# Altium project GLOVETESTER-NFCBOARD.PrjPcb
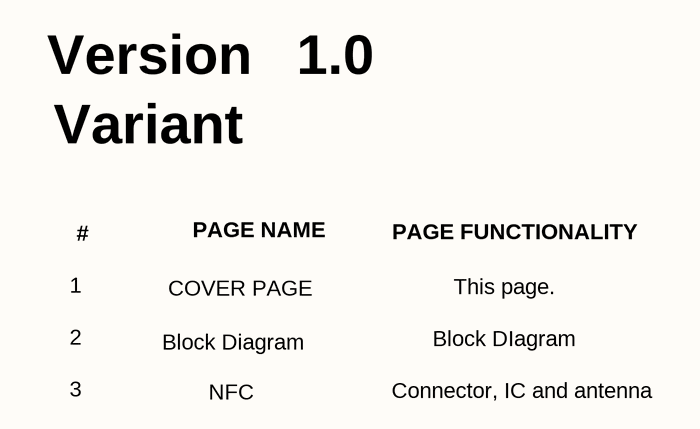
[diagram p0: 01 COVER PAGE.SchDoc]
3 sheets, 51 parts. Net scope: global (net labels, ports and power ports of the same name join across sheets).
Board file: NFC.PcbDoc
Sheets:
  01 COVER PAGE.SchDoc
  02 BLOCK DIAGRAM.SchDoc
  03 NFC.SchDoc

## Sheet 01 COVER PAGE.SchDoc
size A3; SheetNumber: 1; SheetTotal: 3

### Notes on the sheet
- Version
- 1.0
- Variant
- #
- PAGE NAME
- COVER PAGE
- PAGE FUNCTIONALITY
- This page.
- 1
- 2
- Block Diagram
- Block DIagram
- 3
- NFC
- Connector, IC and antenna
- Size
- Author
- Revision
- embedded-consultants.com <http://embedded-consultants.com>
- Sheet
- Date
- of

## Sheet 02 BLOCK DIAGRAM.SchDoc
size A3; SheetNumber: 2; SheetTotal: 3
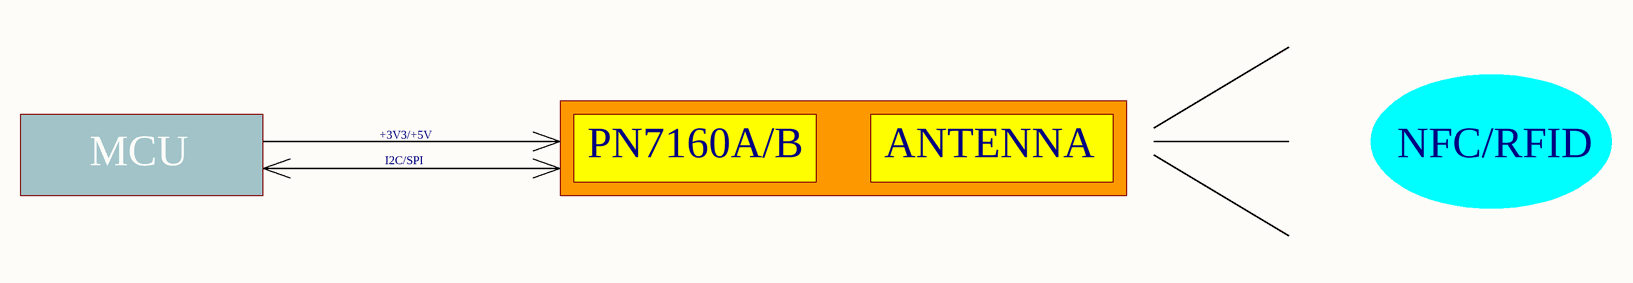
[diagram p1: 02 BLOCK DIAGRAM.SchDoc]

### Notes on the sheet
- +3V3/+5V
- I2C/SPI
- PN7160A/B
- ANTENNA
- NFC/RFID
- MCU
- Size
- Author
- Revision
- embedded-consultants.com <http://embedded-consultants.com>
- Sheet
- Date
- of

## Sheet 03 NFC.SchDoc: 03 NFC
size A3; Date: 2026.4.28.; Author: Silard G.; Revision: 1.0; SheetNumber: 3; SheetTotal: 3; Size: A3
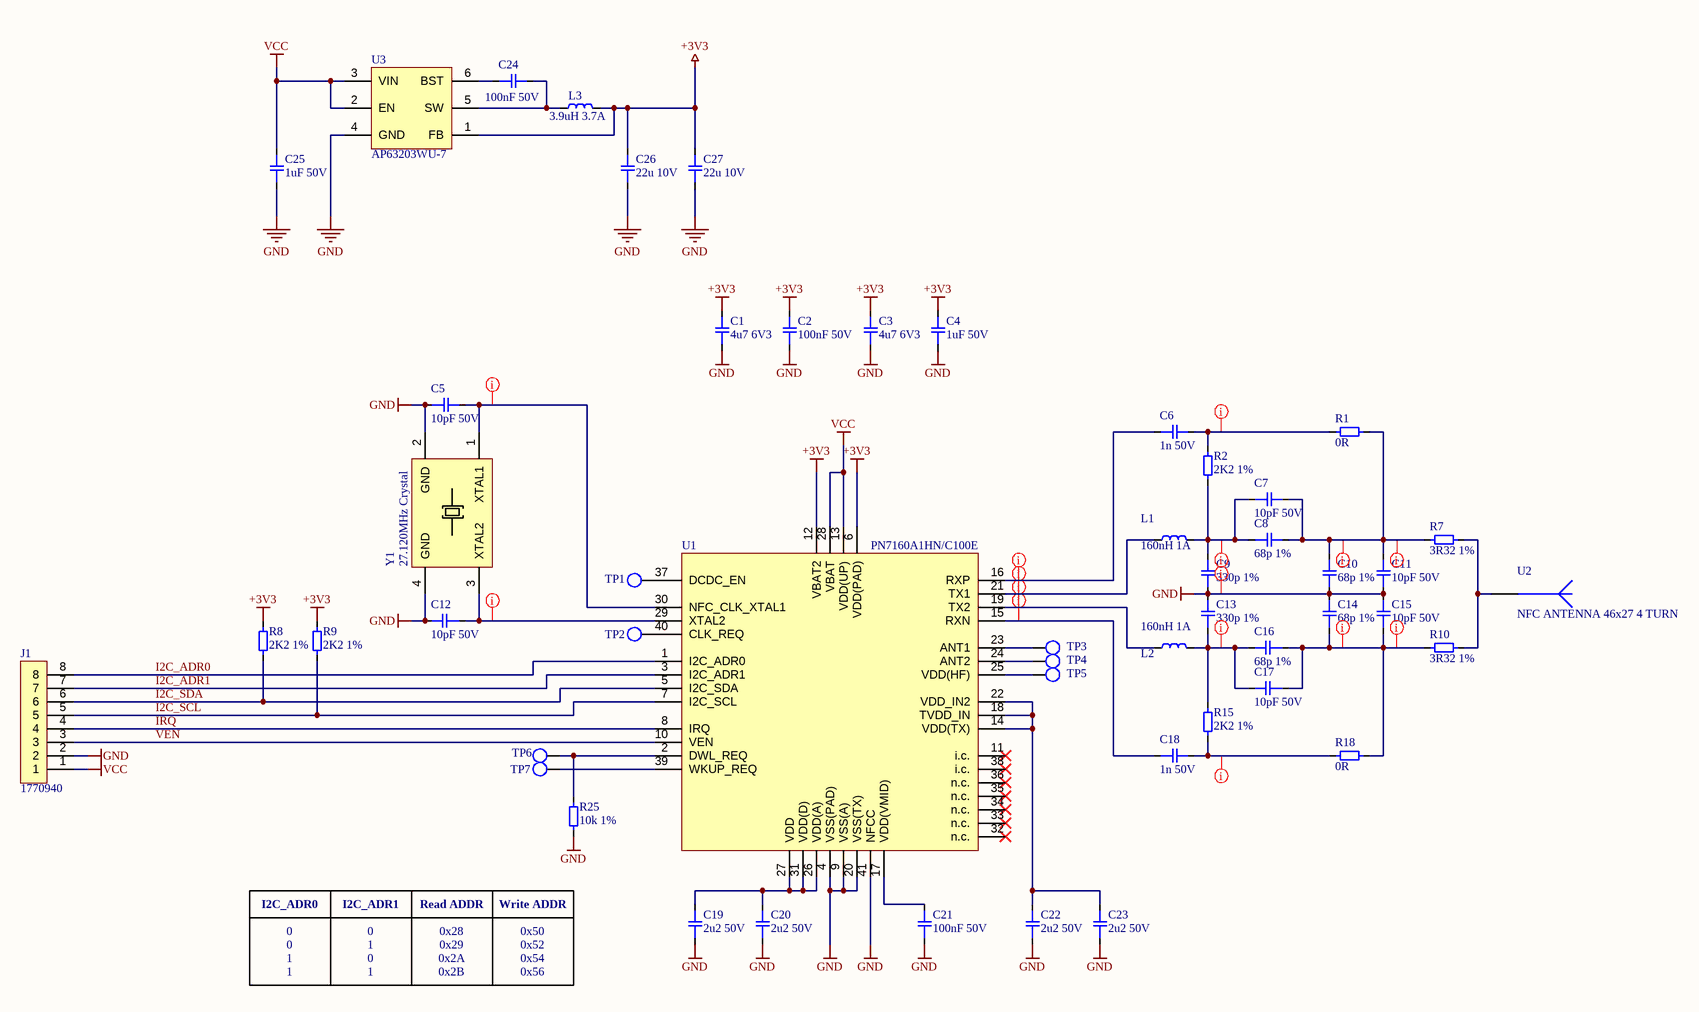
[diagram p2: 03 NFC.SchDoc]

### Parts
C1  4u7 6V3  [CAPC1005X05N_MURATA_GRT]
C2  100nF 50V  [CAPC1005X05N_MURATA_GCM]
C3  4u7 6V3  [CAPC1005X05N_MURATA_GRT]
C4  1uF 50V  [CAPC1005X05N_MURATA_GRM]
C5  10pF 50V  [CAPC1005X05N_MURATA_GRM]
C6  1n 50V  [CAPC1005X05N_MURATA_GCM]
C7  10pF 50V  [CAPC1005X05N_MURATA_GRM]
C8  68p 1%  [CAPC1005X05N_MURATA_GCM]
C9  330p 1%  [CAPC1005X05N_MURATA_GCM]
C10  68p 1%  [CAPC1005X05N_MURATA_GCM]
C11  10pF 50V  [CAPC1005X05N_MURATA_GRM]
C12  10pF 50V  [CAPC1005X05N_MURATA_GRM]
C13  330p 1%  [CAPC1005X05N_MURATA_GCM]
C14  68p 1%  [CAPC1005X05N_MURATA_GCM]
C15  10pF 50V  [CAPC1005X05N_MURATA_GRM]
C16  68p 1%  [CAPC1005X05N_MURATA_GCM]
C17  10pF 50V  [CAPC1005X05N_MURATA_GRM]
C18  1n 50V  [CAPC1005X05N_MURATA_GCM]
C19  2u2 50V  [CAPC1608X08N_MURATA_GRT]
C20  2u2 50V  [CAPC1608X08N_MURATA_GRT]
C21  100nF 50V  [CAPC1005X05N_MURATA_GCM]
C22  2u2 50V  [CAPC1608X08N_MURATA_GRT]
C23  2u2 50V  [CAPC1608X08N_MURATA_GRT]
C24  100nF 50V  [CAPC1005X05N_MURATA_GCM]
C25  1uF 50V  [CAPC1005X05N_MURATA_GRM]
C26  22u 10V  [CAPC3216X18N_MURATA_GCM]
C27  22u 10V  [CAPC3216X18N_MURATA_GCM]
J1  1770940  [1770940]
L1  160nH 1A  [LQW18]
L2  160nH 1A  [LQW18]
L3  3.9uH 3.7A  [IFSC2020DZER3R9N01]
R1  0R  [RESC1005X04N_YAGEO_RC]
R2  2K2 1%  [RESC1005X04N_YAGEO_RC]
R7  3R32 1%  [RESC1005X04N_YAGEO_RC]
R8  2K2 1%  [RESC1005X04N_YAGEO_RC]
R9  2K2 1%  [RESC1005X04N_YAGEO_RC]
R10  3R32 1%  [RESC1005X04N_YAGEO_RC]
R15  2K2 1%  [RESC1005X04N_YAGEO_RC]
R18  0R  [RESC1005X04N_YAGEO_RC]
R25  10k 1%  [RESC1005X04N_YAGEO_RC]
TP1  Test Point 1mm  [Test Point 1mm]  (value not drawn)
TP2  Test Point 1mm  [Test Point 1mm]  (value not drawn)
TP3  Test Point 1mm  [Test Point 1mm]  (value not drawn)
TP4  Test Point 1mm  [Test Point 1mm]  (value not drawn)
TP5  Test Point 1mm  [Test Point 1mm]  (value not drawn)
TP6  Test Point 1mm  [Test Point 1mm]  (value not drawn)
TP7  Test Point 1mm  [Test Point 1mm]  (value not drawn)
U1  PN7160A1HN/C100E  [QFN50P600X600X100-41N-D]
U2  NFC ANTENNA 46x27 4 TURN  [NFC ANTENNA 46x27 4TURN]  (no BOM)
U3  AP63203WU-7  [TSOT-26-6]
Y1  27.120MHz Crystal  [ABM3B]

### Nets
+3V3: C1.2 C2.2 C3.2 C4.2 C26.2 C27.2 L3.2 R8.1 R9.1 U1.6(VDD(PAD)) U1.12(VBAT2) U3.1(FB)
GND: C1.1 C2.1 C3.1 C4.1 C5.1 C9.1 C10.1 C11.1 C12.2 C13.2 C14.2 C15.2 C19.1 C20.1 C21.1 C22.1 C23.1 C25.1 C26.1 C27.1 J1.2 R25.1 U1.4(VSS(PAD)) U1.9(VSS(A)) U1.20(VSS(TX)) U1.41(NFCC) U3.4(GND) Y1.2(GND) Y1.4(GND)
VCC: C25.2 J1.1 U1.13(VDD(UP)) U1.28(VBAT) U3.2(EN) U3.3(VIN)
I2C_ADR0: J1.8 U1.1(I2C_ADR0)
I2C_ADR1: J1.7 U1.3(I2C_ADR1)
I2C_SCL: J1.5 R9.2 U1.7(I2C_SCL)
I2C_SDA: J1.6 R8.2 U1.5(I2C_SDA)
IRQ: J1.4 U1.8(IRQ)
VEN: J1.3 U1.10(VEN)
NetC5_2: C5.2 U1.30(NFC_CLK_XTAL1) Y1.1(XTAL1)
NetC6_1: C6.1 U1.16(RXP)
NetC6_2: C6.2 R1.1 R2.1
NetC7_1: C7.1 C8.1 C9.2 L1.2 R2.2
NetC7_2: C7.2 C8.2 C10.2 C11.2 R1.2 R7.1
NetC12_1: C12.1 U1.29(XTAL2) Y1.3(XTAL2)
NetC13_1: C13.1 C16.2 C17.2 L2.2 R15.1
NetC14_1: C14.1 C15.1 C16.1 C17.1 R10.1 R18.2
NetC18_1: C18.1 U1.15(RXN)
NetC18_2: C18.2 R15.2 R18.1
NetC19_2: C19.2 C20.2 U1.26(VDD(A)) U1.27(VDD) U1.31(VDD(D))
NetC21_2: C21.2 U1.17(VDD(VMID))
NetC22_2: C22.2 C23.2 U1.14(VDD(TX)) U1.18(TVDD_IN) U1.22(VDD_IN2)
NetC24_1: C24.1 U3.6(BST)
NetC24_2: C24.2 L3.1 U3.5(SW)
NetL1_1: L1.1 U1.21(TX1)
NetL2_1: L2.1 U1.19(TX2)
NetR7_2: R7.2 R10.2 U2.1
NetR25_2: R25.2 TP6.1 U1.2(DWL_REQ)
NetTP1_1: TP1.1 U1.37(DCDC_EN)
NetTP2_1: TP2.1 U1.40(CLK_REQ)
NetTP3_1: TP3.1 U1.23(ANT1)
NetTP4_1: TP4.1 U1.24(ANT2)
NetTP5_1: TP5.1 U1.25(VDD(HF))
NetTP7_1: TP7.1 U1.39(WKUP_REQ)

Not connected (* = marked no-connect by the designer): U1 11(i.c.)* 32(n.c.)* 33(n.c.)* 34(n.c.)* 35(n.c.)* 36(n.c.)* 38(i.c.)*

### Layout directives
net class 50OHM: GND, NetC5_2, NetC6_1, NetC6_2, NetC7_1, NetC7_2, NetC12_1, NetC13_1, NetC14_1, NetC18_1, NetC18_2, NetL1_1, NetL2_1

### Notes on the sheet
- I2C_ADR0
- I2C_ADR1
- Read ADDR
- Write ADDR
- 0
- 1
- 0x28
- 0x29
- 0x2A
- 0x2B
- 0x50
- 0x52
- 0x54
- 0x56
- Size
- Author
- Revision
- embedded-consultants.com <http://embedded-consultants.com>
- Sheet
- Date
- of

### Library data of the parts
C1 C3 = 4u7 6V3: Multilayer Ceramic Capacitors MLCC - SMD/SMT 4.7 uF 6.3 VDC 20% 0402 X6S AEC-Q200; Manufacturer: MURATA; MPN: GRT155C80J475ME13D; Suppplier: Mouser; Supplier MPN: 81-GRT155C80J475ME13
C2 C21 C24 = 100nF 50V: Multilayer Ceramic Capacitors MLCC - SMD/SMT 0.1 uF 50 VDC 10% 0402 X7R AEC-Q200; Manufacturer: MURATA; MPN: GCM155R71H104KE02D; Suppplier: Mouser; Supplier MPN: 81-GCM155R71H104KE2D
C4 C25 = 1uF 50V: Multilayer Ceramic Capacitors MLCC - SMD/SMT 1 uF 50 VDC 10% 0402 X5R; Manufacturer: MURATA; MPN: GRM155R61H105KE05D; Suppplier: Mouser; Supplier MPN: 81-GRM155R61H105KE5D
C5 C7 C11 C12 C15 C17 = 10pF 50V: Multilayer Ceramic Capacitors MLCC - SMD/SMT 10 pF 50 VDC 2% 0402 C0G (NP0); Manufacturer: MURATA; MPN: GRM1555C1H100GA01D; Suppplier: Mouser; Supplier MPN: 81-GRM1555C1H100GA1D
C6 C18 = 1n 50V: Multilayer Ceramic Capacitors MLCC - SMD/SMT 1000 pF 50 VDC 2% 0402 C0G (NP0) AEC-Q200; Manufacturer: MURATA; MPN: GCM1555C1H102GA16J; Suppplier: Mouser; Supplier MPN: 81-GCM1555C1H102GA6J
C8 C10 C14 C16 = 68p 1%: Multilayer Ceramic Capacitors MLCC - SMD/SMT 0402 100VDC 68pF 5% C0G AEC-Q200; Manufacturer: MURATA; MPN: GCM1555C2A680JE02D; Suppplier: Mouser; Supplier MPN: 81-GCM1555C2A680JE2D
C9 C13 = 330p 1%: Multilayer Ceramic Capacitors MLCC - SMD/SMT 0402 100VDC 330pF 5% C0G AEC-Q200; Manufacturer: MURATA; MPN: GCM1555C2A331JE02D; Suppplier: Mouser; Supplier MPN: 81-GCM1555C2A331JE2D
C19 C20 C22 C23 = 2u2 50V: Multilayer Ceramic Capacitors MLCC - SMD/SMT 2.2 uF 50 VDC 10% 0603 X5R AEC-Q200; Manufacturer: MURATA; MPN: GRT188R61H225KE13D; Suppplier: Mouser; Supplier MPN: 81-GRT188R61H225KE3D
C26 C27 = 22u 10V: Multilayer Ceramic Capacitors MLCC - SMD/SMT 22 uF 10 VDC 10% 1206 X7R AEC-Q200; Manufacturer: MURATA; MPN: GCM31CR71A226KE02L; Suppplier: Mouser; Supplier MPN: 81-GCM31CR71A226KE2L
J1 = 1770940: Fixed Terminal Blocks PTSM 0,5/ 8-2,5-H THR R32; Manufacturer: Phoenix Contact; MPN: 1770940; Supplier: Mouser; Supplier PN: 651-1770940
L1 L2 = 160nH 1A: RF Inductors - SMD 160nH 1000mA AEC-Q200; Manufacturer: Murata Electronics; MPN: LQW18CNR16J0HD; Supplier: Mouser; Supplier PN: 81-LQW18CNR16J0HD
L3 = 3.9uH 3.7A: Power Inductors - SMD 3.9UH 3.7A 35 MOHM SMD; Manufacturer: Vishay / Dale; MPN: IFSC2020DZER3R9N01; Supplier: Mouser; Supplier PN: 70-IFSC2020DZR3R9N01
R1 R18 = 0R: Thick Film Resistors - SMD General Purpose Chip Resistor 0402, 0Ohms, 1%, 1/16W; Manufacturer: YAGEO; MPN: RC0402FR-070RL; Supplier: Mouser; Supplier PN: 603-RC0402FR-070RL
R2 R8 R9 R15 = 2K2 1%: Thick Film Resistors - SMD General Purpose Chip Resistor 0402, 2.2kOhms, 5%, 1/16W; Manufacturer: YAGEO; MPN: RC0402JR-7D2K2L; Supplier: Mouser; Supplier PN: 603-RC0402JR-7D2K2L
R7 R10 = 3R32 1%: Thick Film Resistors - SMD General Purpose Chip Resistor 0402, 3.32Ohms, 1%, 1/16W; Manufacturer: YAGEO; MPN: RC0402FR-073R32L; Supplier: Mouser; Supplier PN: 603-RC0402FR-073R32L
R25 = 10k 1%: Thick Film Resistors - SMD General Purpose Chip Resistor 0402, 10kOhms, 1%, 1/16W; Manufacturer: YAGEO; MPN: RC0402FR-0710KL; Supplier: Mouser; Supplier PN: 603-RC0402FR-0710KL
U1 = PN7160A1HN/C100E_1: NFC/RFID Tags & Transponders NFC Plug and Play Controller with Integrated Firmware and NCI Interface; Manufacturer: NXP Semiconductors; MPN: PN7160A1HN/C100E; Supplier: Mouser; Supplier MPN: 771-PN7160A1HN/C100E
U2 = NFC ANTENNA 46x27 4 TURN: Manufacturer: None; MPN: NFC ANTENNA 46x27 4 TURN; Supplier: None; Supplier MPN: NFC ANTENNA 46x27 4 TURN
U3 = AP63203WU-7: Switching Voltage Regulators DCDC Conv HV Buck TSOT26 T&R 3K 3V3 OUT; Manufacturer: Diodes Incorporated; MPN: AP63203WU-7; Supplier: Mouser; Supplier PN: 621-AP63203WU-7
Y1 = 27.120MHz Crystal: Crystals 27.12 MHZ 10PF 10PPM -40+85C; MPN: ABM3B-27.120MHZ-10-D1G-T; Manufacturer: ABRACON; Supplier: Mouser; Supplier MPN: 815-ABM3B-27.110D1GT

## Assembly variants
Manufacturing: not fitted C? C? C? C? R20 R22 R? R? R? R? R? R?